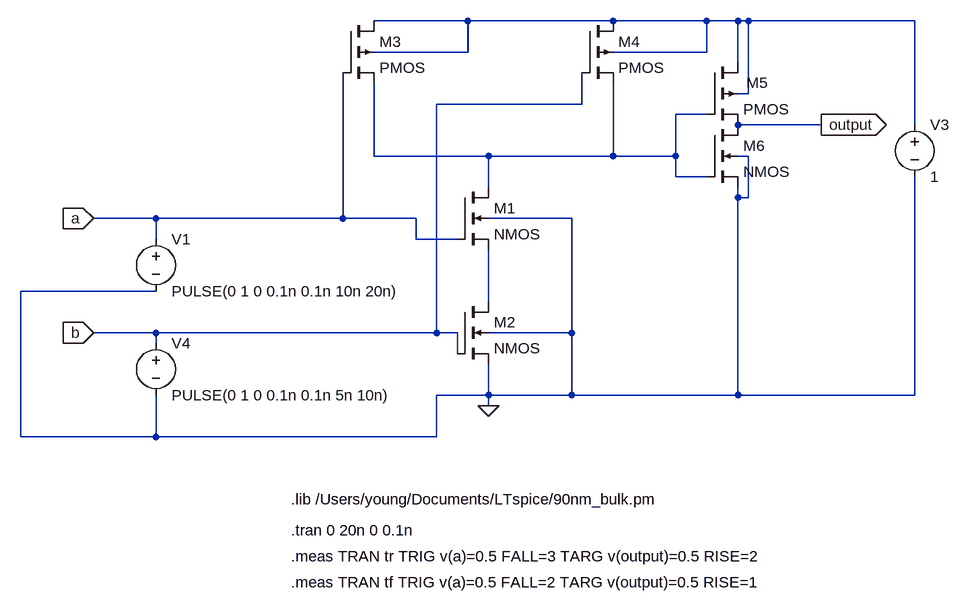
[diagram p0: schematic and.asc]
and.asc, the LTspice schematic file:
Version 4
SHEET 1 1196 864
WIRE 160 -96 16 -96
WIRE 384 -96 160 -96
WIRE 528 -96 384 -96
WIRE 576 -96 528 -96
WIRE 592 -96 576 -96
WIRE 848 -96 592 -96
WIRE 160 -48 160 -96
WIRE 160 -48 16 -48
WIRE 528 -48 528 -96
WIRE 528 -48 384 -48
WIRE 576 -32 576 -96
WIRE 592 16 592 -96
WIRE 592 16 576 16
WIRE 336 32 336 -16
WIRE 336 32 112 32
WIRE 528 48 480 48
WIRE 704 64 576 64
WIRE 848 64 848 -96
WIRE 16 112 16 0
WIRE 192 112 16 112
WIRE 384 112 384 0
WIRE 384 112 192 112
WIRE 480 112 480 48
WIRE 480 112 384 112
WIRE 592 112 576 112
WIRE 480 144 480 112
WIRE 528 144 480 144
WIRE 192 160 192 112
WIRE 576 176 576 160
WIRE 592 176 592 112
WIRE 592 176 576 176
WIRE -320 208 -416 208
WIRE -32 208 -32 -16
WIRE -32 208 -320 208
WIRE 80 208 -32 208
WIRE 320 208 192 208
WIRE -320 240 -320 208
WIRE 80 240 80 208
WIRE 144 240 80 240
WIRE -320 320 -528 320
WIRE 192 336 192 256
WIRE -320 384 -416 384
WIRE 112 384 112 32
WIRE 112 384 -320 384
WIRE 144 384 112 384
WIRE 320 384 320 208
WIRE 320 384 192 384
WIRE -320 400 -320 384
WIRE 144 416 144 384
WIRE 192 480 192 432
WIRE 192 480 112 480
WIRE 320 480 320 384
WIRE 320 480 192 480
WIRE 576 480 576 176
WIRE 576 480 320 480
WIRE 848 480 848 144
WIRE 848 480 576 480
WIRE 192 496 192 480
WIRE -528 544 -528 320
WIRE -320 544 -320 480
WIRE -320 544 -528 544
WIRE 112 544 112 480
WIRE 112 544 -320 544
FLAG 704 64 output
IOPIN 704 64 Out
FLAG -416 208 a
IOPIN -416 208 In
FLAG -416 384 b
IOPIN -416 384 In
FLAG 192 496 0
SYMBOL nmos4 144 160 R0
SYMATTR InstName M1
SYMATTR Value2 l=200n w=200n
SYMBOL nmos4 144 336 R0
SYMATTR InstName M2
SYMATTR Value2 l=200n w=200n
SYMBOL pmos4 -32 -96 R0
SYMATTR InstName M3
SYMATTR Value2 l=200n w=400n
SYMBOL pmos4 336 -96 R0
SYMATTR InstName M4
SYMATTR Value2 l=200n w=400n
SYMBOL voltage -320 224 R0
WINDOW 123 0 0 Left 0
WINDOW 39 0 0 Left 0
SYMATTR InstName V1
SYMATTR Value PULSE(0 1 0 0.1n 0.1n 10n 20n)
SYMBOL voltage 848 48 R0
WINDOW 123 0 0 Left 0
WINDOW 39 0 0 Left 0
SYMATTR InstName V3
SYMATTR Value 1
SYMBOL voltage -320 384 R0
WINDOW 123 0 0 Left 0
WINDOW 39 0 0 Left 0
SYMATTR InstName V4
SYMATTR Value PULSE(0 1 0 0.1n 0.1n 5n 10n)
SYMBOL pmos4 528 -32 R0
WINDOW 0 61 31 Left 2
SYMATTR InstName M5
SYMATTR Value2 l=200N w=400N
SYMBOL nmos4 528 64 R0
SYMATTR InstName M6
SYMATTR Value2 l=200N w=200N
TEXT -112 640 Left 2 !.lib /Users/young/Documents/LTspice/90nm_bulk.pm
TEXT -112 688 Left 2 !.tran 0 20n 0 0.1n
TEXT -112 728 Left 2 !.meas TRAN tr TRIG v(a)=0.5 FALL=3 TARG v(output)=0.5 RISE=2
TEXT -112 768 Left 2 !.meas TRAN tf TRIG v(a)=0.5 FALL=2 TARG v(output)=0.5 RISE=1

The netlist it stands for:
* and.asc
M1 N002 a N003 0 NMOS l=200n w=200n
M2 N003 b 0 0 NMOS l=200n w=200n
M3 N001 a N002 N001 PMOS l=200n w=400n
M4 N001 b N002 N001 PMOS l=200n w=400n
V1 a 0 PULSE(0 1 0 0.1n 0.1n 10n 20n)
V3 N001 0 1
V4 b 0 PULSE(0 1 0 0.1n 0.1n 5n 10n)
M5 N001 N002 output N001 PMOS l=200N w=400N
M6 output N002 0 0 NMOS l=200N w=200N
.model NMOS NMOS
.model PMOS PMOS
.lib standard.mos
.lib /Users/young/Documents/LTspice/90nm_bulk.pm
.tran 0 20n 0 0.1n
.meas TRAN tr TRIG v(a)=0.5 FALL=3 TARG v(output)=0.5 RISE=2
.meas TRAN tf TRIG v(a)=0.5 FALL=2 TARG v(output)=0.5 RISE=1
.backanno
.end